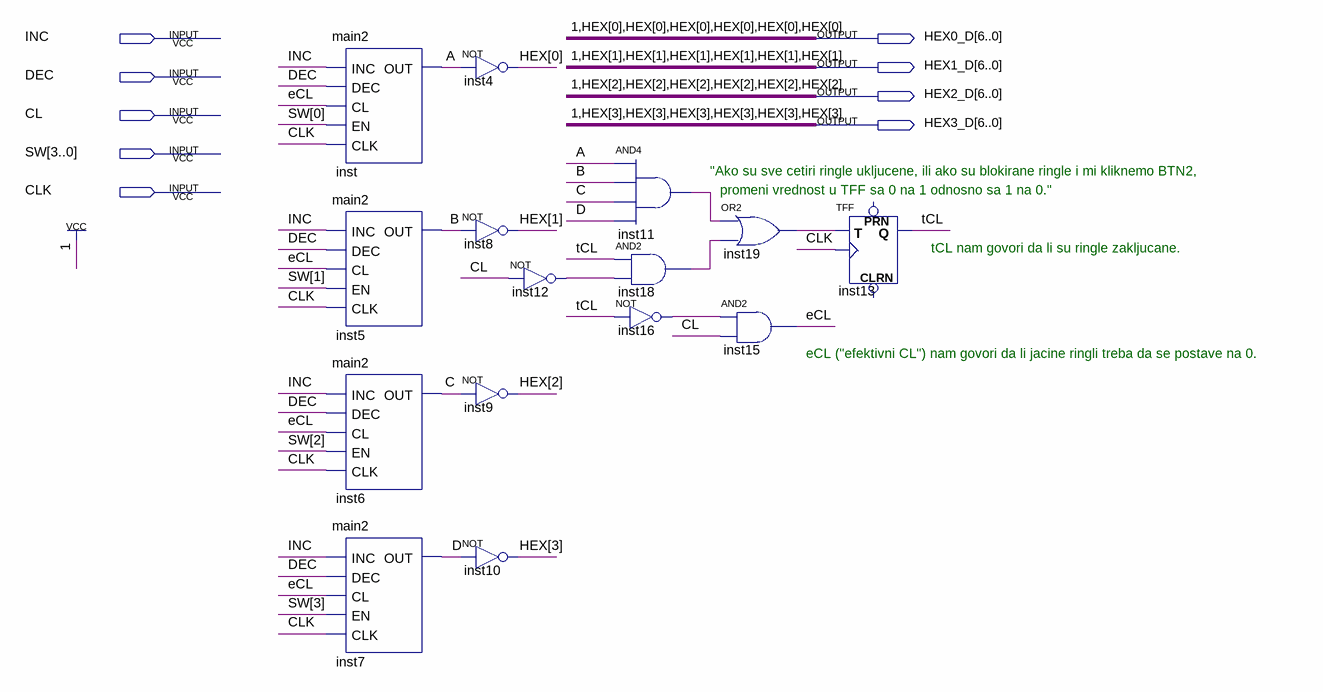
[diagram p0: schematic sheet]
// Quartus schematic main3.bdf as structural Verilog: 15 symbols, 9 pins
module main3 (
  input  INC,
  input  DEC,
  input  CL,
  input  [3:0] SW,
  input  CLK,
  output [6:0] HEX0_D,
  output [6:0] HEX1_D,
  output [6:0] HEX2_D,
  output [6:0] HEX3_D
);

  wire A, B, C, D, eCL, inst11_out, inst12_out, inst16_out, inst18_out, inst19_out, tCL;

  main2 inst (.INC(INC), .DEC(DEC), .CL(eCL), .EN(SW[0]), .CLK(CLK), .OUT(A));
  main2 inst5 (.INC(INC), .DEC(DEC), .CL(eCL), .EN(SW[1]), .CLK(CLK), .OUT(B));
  main2 inst6 (.INC(INC), .DEC(DEC), .CL(eCL), .EN(SW[2]), .CLK(CLK), .OUT(C));
  main2 inst7 (.INC(INC), .DEC(DEC), .CL(eCL), .EN(SW[3]), .CLK(CLK), .OUT(D));
  not inst4 (HEX0_D[5], A);
  not inst8 (HEX1_D[5], B);
  not inst9 (HEX2_D[5], C);
  not inst10 (HEX3_D[5], D);
  not inst12 (inst12_out, CL);
  and inst11 (inst11_out, A, B, C, D);
  and inst18 (inst18_out, tCL, inst12_out);
  not inst16 (inst16_out, tCL);
  or inst19 (inst19_out, inst11_out, inst18_out);
  and inst15 (eCL, inst16_out, CL);
  TFF inst13 (.T(inst19_out), .CLK(CLK), .Q(tCL));  // open: PRN, CLRN

  assign {HEX0_D[6], HEX0_D[4:0]} = {1'b1, {5{HEX0_D[5]}}};
  assign {HEX1_D[6], HEX1_D[4:0]} = {1'b1, {5{HEX1_D[5]}}};
  assign {HEX2_D[6], HEX2_D[4:0]} = {1'b1, {5{HEX2_D[5]}}};
  assign {HEX3_D[6], HEX3_D[4:0]} = {1'b1, {5{HEX3_D[5]}}};

  // Other names for the same wires on the sheet: HEX[3:0] = {HEX3_D[5], HEX2_D[5], HEX1_D[5], HEX0_D[5]}

  // Notes on the sheet:
  //   "Ako su sve cetiri ringle ukljucene, ili ako su blokirane ringle i mi kliknemo BTN2,
  //   promeni vrednost u TFF sa 0 na 1 odnosno sa 1 na 0."
  //   tCL nam govori da li su ringle zakljucane.
  //   eCL ("efektivni CL") nam govori da li jacine ringli treba da se postave na 0.
endmodule
